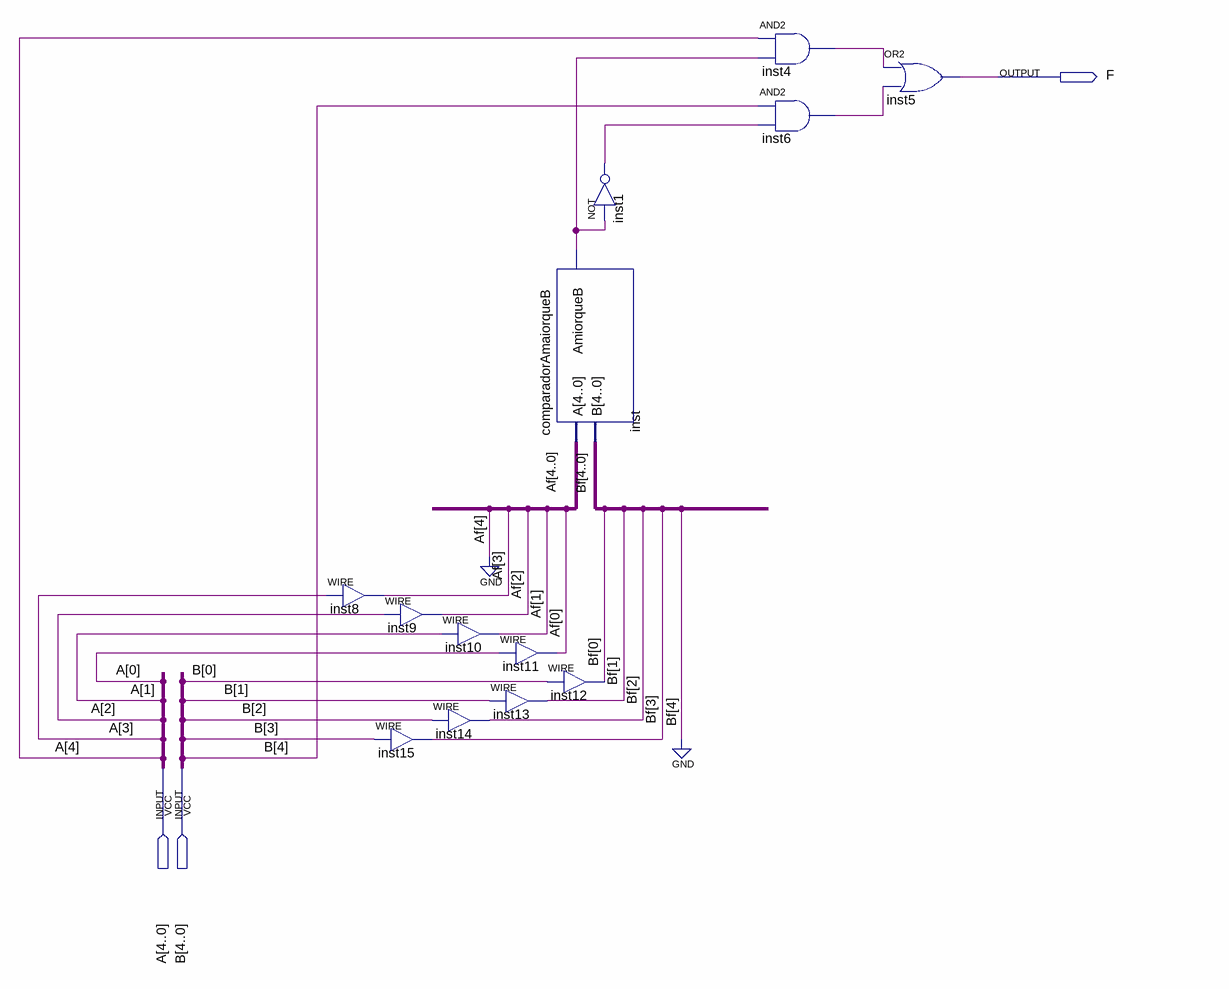
[diagram p0: schematic sheet]
// Quartus schematic MUXsomador.bdf as structural Verilog: 13 symbols, 3 pins
module MUXsomador (
  input  [4:0] A,
  input  [4:0] B,
  output F
);

  wire inst1_out, inst4_out, inst6_out, inst_amiorqueb;
  wire [3:0] Af, Bf;

  assign Af[3] = A[3];  // WIRE inst8
  assign Bf[3] = B[3];  // WIRE inst15
  assign Af[2] = A[2];  // WIRE inst9
  assign Af[1] = A[1];  // WIRE inst10
  assign Bf[2] = B[2];  // WIRE inst14
  assign Af[0] = A[0];  // WIRE inst11
  assign Bf[1] = B[1];  // WIRE inst13
  not inst1 (inst1_out, inst_amiorqueb);
  comparadorAmaiorqueB inst (.A({1'b0, Af}), .B({1'b0, Bf}), .AmiorqueB(inst_amiorqueb));
  assign Bf[0] = B[0];  // WIRE inst12
  and inst4 (inst4_out, A[4], inst_amiorqueb);
  and inst6 (inst6_out, B[4], inst1_out);
  or inst5 (F, inst4_out, inst6_out);
endmodule
